# Altium schematic sheet sfp.SchDoc: SFP
size 297 x 209 mm; CheckedBy: MC, TW, EB; CompanyName: CERN; DrawnBy: Greg Kasprowicz; Organization: CERN; Address1: European Organization for Nuclear Research; Address2: CH-1211 Geneve 23 - Switzerland; DocumentNumber: 16; Revision: -; SheetNumber: 16; SheetTotal: 17; EDA_Number: EDA-02189-V4-0; Projet: Simple PCIe Carrier Board; Designer: GK, MC, TW, EB, PAS; DivGrp: BE-CO; CreateDate: 10/07/2010; CheckedDate: 11/05/2011; ModifiedBy: TW, MC; ProjectName: Simple PCIe Carrier Board
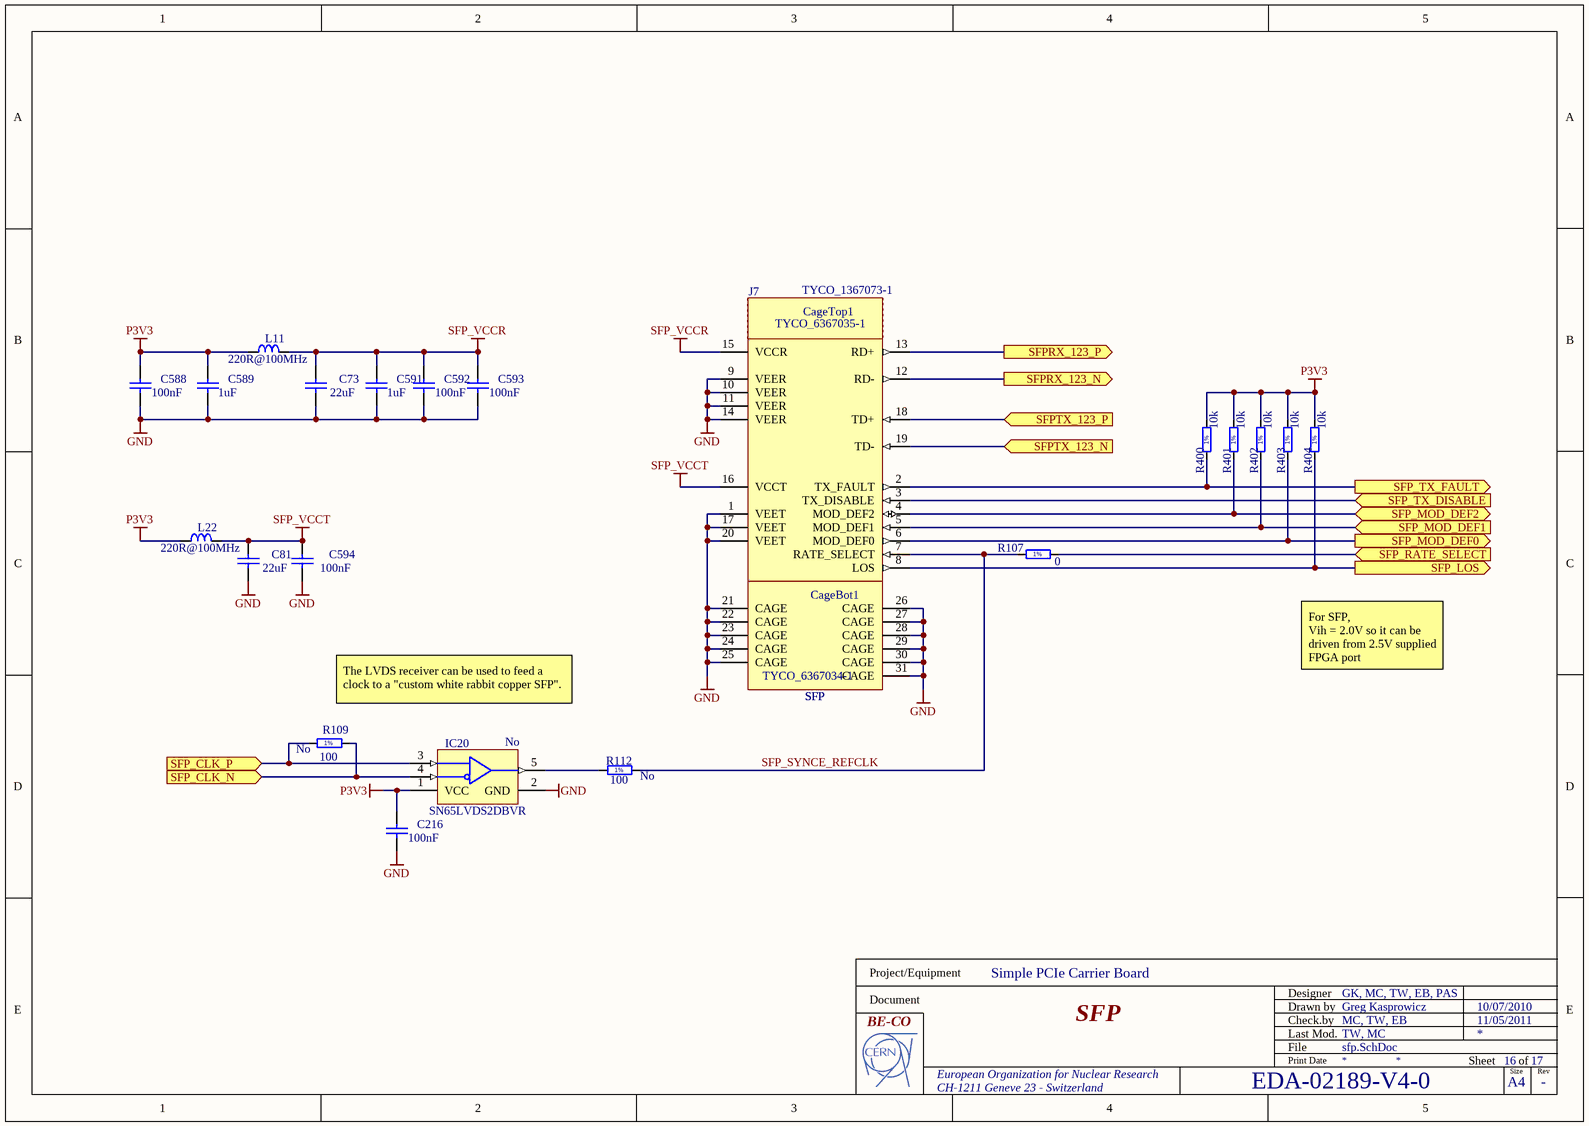
[diagram p0: sfp.SchDoc]

## Parts
C73  22uF  [CAPC3216X180N]
C81  22uF  [CAPC3216X180N]
C216  100nF  [CAPC1608X87N]
C588  100nF  [CAPC1608X87N]
C589  1uF  [CAPC1608X87N]
C591  1uF  [CAPC1608X87N]
C592  100nF  [CAPC1608X87N]
C593  100nF  [CAPC1608X87N]
C594  100nF  [CAPC1608X87N]
CageBot1  SFP  [TYCO_6367034-1]
CageTop1  SFP  [TYCO_6367035-1]
IC20  SN65LVDS2DBVR  Mounted: No  [SOT95P280X145-5N]
J7  SFP  [TYCO_1367073-1]
L11  220R@100MHz  [INDC2012X105N]
L22  220R@100MHz  [INDC2012X105N]
R107  0  [RESC1608X55N]
R109  100  Mounted: No  [RESC1608X55N]
R112  100  Mounted: No  [RESC1608X55N]
R400  10k  [RESC1608X55N]
R401  10k  [RESC1608X55N]
R402  10k  [RESC1608X55N]
R403  10k  [RESC1608X55N]
R404  10k  [RESC1608X55N]

## Ports
SFP_CLK_N (in), SFP_CLK_P (in), SFP_LOS (out), SFP_MOD_DEF0 (out), SFP_MOD_DEF1 (in), SFP_MOD_DEF2 (bidir), SFP_RATE_SELECT (in), SFP_TX_DISABLE (in), SFP_TX_FAULT (out), SFPRX_123_N (out), SFPRX_123_P (out), SFPTX_123_N (in), SFPTX_123_P (in)

## Nets
GND: C73.1 C81.1 C216.2 C588.1 C589.1 C591.1 C592.1 C593.1 C594.1 CageBot1.21(CAGE) CageBot1.22(CAGE) CageBot1.23(CAGE) CageBot1.24(CAGE) CageBot1.25(CAGE) CageBot1.26(CAGE) CageBot1.27(CAGE) CageBot1.28(CAGE) CageBot1.29(CAGE) CageBot1.30(CAGE) CageBot1.31(CAGE) IC20.2(GND) J7.1(VEET) J7.9(VEER) J7.10(VEER) J7.11(VEER) J7.14(VEER) J7.17(VEET) J7.20(VEET)
P3V3: C216.1 C588.2 C589.2 IC20.1(VCC) L11.1 L22.1 R400.2 R401.2 R402.2 R403.2 R404.2
SFP_VCCR: C73.2 C591.2 C592.2 C593.2 J7.15(VCCR) L11.2
SFP_VCCT: C81.2 C594.2 J7.16(VCCT) L22.2
SFP_CLK_N: IC20.4(B) R109.2 ; port SFP_CLK_N
SFP_CLK_P: IC20.3(A) R109.1 ; port SFP_CLK_P
SFP_LOS: J7.8(LOS) R404.1 ; port SFP_LOS
SFP_MOD_DEF0: J7.6(MOD_DEF0) R403.1 ; port SFP_MOD_DEF0
SFP_MOD_DEF1: J7.5(MOD_DEF1) R402.1 ; port SFP_MOD_DEF1
SFP_MOD_DEF2: J7.4(MOD_DEF2) R401.1 ; port SFP_MOD_DEF2
SFP_RATE_SELECT: R107.2 ; port SFP_RATE_SELECT
SFP_SYNCE_REFCLK: J7.7(RATE_SELECT) R107.1 R112.2
SFP_TX_DISABLE: J7.3(TX_DISABLE) ; port SFP_TX_DISABLE
SFP_TX_FAULT: J7.2(TX_FAULT) R400.1 ; port SFP_TX_FAULT
SFPRX_123_N: J7.12(RD-) ; port SFPRX_123_N
SFPRX_123_P: J7.13(RD+) ; port SFPRX_123_P
SFPTX_123_N: J7.19(TD-) ; port SFPTX_123_N
SFPTX_123_P: J7.18(TD+) ; port SFPTX_123_P
NetIC20_5: IC20.5(R) R112.1

## Notes on the sheet
- For SFP,
  Vih = 2.0V so it can be driven from 2.5V supplied FPGA port
- The LVDS receiver can be used to feed a clock to a "custom white rabbit copper SFP".
- Project/Equipment
- Document
- Designer
- Drawn by
- Check.by
- File
- Last Mod.
- Print Date
- Sheet
- Size
- A4
- of
- Rev
- (in symbol R0603_0R_JUMPER) 1%
- (in symbol R0603_10K_1%_0.1W_100PPM) 1%
- (in symbol R0603_100R_1%_0.1W_100PPM) 1%
- (in symbol TYCO_1367073-1) Add Cage Top Here; (Ex: TYCO_6367035-1); Add Cage Bottom Here; (Ex: TYCO_6367034-1)

## Library data of the parts
C73 C81 = CC1206_22UF_10V_10%_X7R: Non-polarised capacitor; Part Description: SMD Multilayer Chip Ceramic Capacitor; Manufacturer: GENERIC; Manufacturer1 Part Number: GRM31CR71A226KE15L; Voltage: 10V; TC: X7R; Tolerance: ±10%; Table: Capacitors SMD; Part Number: CC1206_22UF_10V_10%_X7R; Component Kind: Standard; Component Type: Standard; Pin Count: 2; Value: 22uF; Status: Preferred; Manufacturer Part Number: CC1206_22UF_10V_10%_X7R; Case: 1206; Mounted: Yes; Socket: No; SMD: Yes; Manufacturer1 Example: MURATA; Manufacturer1 ComponentHeight: 1.8mm; HelpURL: \\cern.ch\dfs\Applications\Altium\Datasheets\CC1206_X7R_MURATA_GRM-HI-CAP.pdf; Author: CERN DEM JLC; CreateDate: 2010-06-08; LatestRevisionDate: 2010-06-08
C216 C588 C592-C594 = CC0603_100NF_50V_10%_X7R: Non-polarised capacitor; Part Description: SMD Multilayer Chip Ceramic Capacitor; Manufacturer: GENERIC; Manufacturer1 Part Number: 223858615649; Voltage: 50V; TC: X7R; Tolerance: ±10%; Table: Capacitors SMD; Part Number: CC0603_100NF_50V_10%_X7R; Component Kind: Standard; Component Type: Standard; Pin Count: 2; Value: 100nF; Status: Preferred; Manufacturer Part Number: CC0603_100NF_50V_10%_X7R; Case: 0603; Mounted: Yes; Socket: No; SMD: Yes; Manufacturer1 Example: PHYCOMP; Manufacturer1 ComponentHeight: 0.87mm; HelpURL: \\cern.ch\dfs\Applications\Altium\Datasheets\CC0603_X7R_PHYCOMP.pdf; Author: CERN DEM JLC
  C216 C588 C592 C593: CreateDate: 12/3/2007; LatestRevisionDate: 12/3/2007
  C594: CreateDate: 03/12/2007; LatestRevisionDate: 03/12/2007
C589 C591 = CC0603_1UF_16V_10%_X7R: Non-polarised capacitor; Part Description: SMD Multilayer Chip Ceramic Capacitor; Manufacturer: GENERIC; Manufacturer1 Part Number: 223824613663; Voltage: 16V; TC: X7R; Tolerance: ±10%; Table: Capacitors SMD; Part Number: CC0603_1UF_16V_10%_X7R; Component Kind: Standard; Component Type: Standard; Pin Count: 2; Value: 1uF; Status: Preferred; Manufacturer Part Number: CC0603_1uF_16V_10%_X7R; Case: 0603; Mounted: Yes; Socket: No; SMD: Yes; Manufacturer1 Example: PHYCOMP; Manufacturer1 ComponentHeight: 0.87mm; HelpURL: \\cern.ch\dfs\Applications\Altium\Datasheets\CC0805_X5R_PHYCOMP_HC.pdf; Author: CERN DEM JLC; CreateDate: 03/12/2007; LatestRevisionDate: 03/12/2007
CageBot1 = TYCO_6367034-1: SFP  Cage Bottom (Small Form-factor Pluggable); Part Description: Cage bottom For Single Port SFP  (Small Form-factor Pluggable); Manufacturer: TYCO ELECTRONICS; Table: TYCO; Part Number: TYCO_6367034-1; Component Kind: Standard; Component Type: Standard; Pin Count: 11; Family: SFP; Mounted: Yes; Socket: No; SMD: No; Status: None; Manufacturer Part Number: TYCO_6367034-1; ComponentHeight: 8.8mm; ComponentLink1URL: \\cern.ch\dfs\Applications\Altium\Datasheets\TYCO_SFP_Application.pdf; ComponentLink1Description: Application; ComponentLink2URL: \\cern.ch\dfs\Applications\Altium\Datasheets\Tyco_SFP_Specification.pdf; ComponentLink2Description: SFP Specification; HelpURL: \\cern.ch\dfs\Applications\Altium\Datasheets\TYCO_6367034-1.pdf; Author: CERN DEM JLC; CreateDate: 25.01.2010; LatestRevisionDate: 25.01.2010; ClassName: Component_Not_DRC
CageTop1 = TYCO_6367035-1: SFP  Cage Top (Small Form-factor Pluggable); Part Description: Cage Top For Single Port SFP  (Small Form-factor Pluggable); Manufacturer: TYCO ELECTRONICS; Table: TYCO; Part Number: TYCO_6367035-1; Component Kind: Standard; Component Type: Standard; Designator: SFPx1_Cage Top; Library Reference: SFPx1_Cage Top; Pin Count: 0; Family: SFP; Mounted: Yes; Socket: No; SMD: No; Status: None; Manufacturer Part Number: TYCO_6367035-1; ComponentHeight: 10mm; Datasheet: \\cern.ch\dfs\Applications\Altium\Datasheets\TYCO_6367035-1.pdf; ComponentLink1URL: \\cern.ch\dfs\Applications\Altium\Datasheets\TYCO_SFP_Application.pdf; ComponentLink1Description: Application; ComponentLink2URL: \\cern.ch\dfs\Applications\Altium\Datasheets\Tyco_SFP_Specification.pdf; ComponentLink2Description: SFP Specification; HelpURL: \\cern.ch\dfs\Applications\Altium\Datasheets\TYCO_6367035-1.pdf; Author: CERN DEM JLC; CreateDate: 25/01/2010; LatestRevisionDate: 25/01/2010; ClassName: Component_Not_DRC
IC20 = SN65LVDS2DBVR: High-Speed Differential Line Receiver; Manufacturer: TEXAS INSTRUMENTS; Table: Analog & Interface; Part Number: SN65LVDS2DBVR; Component Kind: Standard; Component Type: Standard; Device: SN65LVDS2DBVR; PackageDescription: SOT, 0.95mm pitch; 5 pin, 1.60mm W X 2.90mm L X 1.45mm H body, IPC Medium Density; Part Description: High-Speed Differential Line Receiver; Manufacturer Part Number: SN65LVDS2DBVR; Pin Count: 5; Case: SOT23-5; Socket: No; SMD: Yes; ComponentHeight: 1.45mm; Author: CERN DEM JLC; HelpURL: \\cern.ch\dfs\Applications\Altium\Datasheets\SN65LVDS2DBVR.pdf; CreateDate: 3/3/2011; LatestRevisionDate: 3/3/2011
J7 = TYCO_1367073-1: 20 Position SFP  Connector (Small Form-factor Pluggable); Part Description: 20 Position, Pitch 0.8mm SFP  Receptacle (Small Form-factor Pluggable); Manufacturer: TYCO ELECTRONICS; Table: TYCO; Part Number: TYCO_1367073-1; Component Kind: Standard; Component Type: Standard; Pin Count: 20; Family: SFP; Mounted: Yes; Socket: No; SMD: Yes; Status: None; Manufacturer Part Number: 1367073-1; ComponentHeight: 5.4mm; ComponentLink1URL: \\cern.ch\dfs\Applications\Altium\Datasheets\TYCO_SFP_Application.pdf; ComponentLink1Description: Application; ComponentLink2URL: \\cern.ch\dfs\Applications\Altium\Datasheets\Tyco_SFP_Specification.pdf; ComponentLink2Description: SFP Specification; HelpURL: \\cern.ch\dfs\Applications\Altium\Datasheets\TYCO_1367073-1.pdf; Author: CERN DEM JLC; CreateDate: 25/01/2010; LatestRevisionDate: 25/01/2010
L11 L22 = IND0805_MURATA_BLM21PG221SN1D: Inductor; Part Description: SMD EMIFIL Suppression Chip Bead Ferrite; Manufacturer: MURATA; Power: 2A; Resistance: 0.05R; Tolerance: ±25%; Table: Inductors SMD; Part Number: IND0805_MURATA_BLM21PG221SN1D; Component Kind: Standard; Component Type: Standard; Pin Count: 2; Value: 220R@100MHz; Status: None; Manufacturer Part Number: BLM21PG221SN1D; Case: 0805; Mounted: Yes; Socket: No; SMD: Yes; ComponentHeight: 1.05mm; HelpURL: \\cern.ch\dfs\Applications\Altium\Datasheets\IND0402_MURATA_BLM21P.pdf; Author: CERN DEM JLC; CreateDate: 25/01/2010; LatestRevisionDate: 25/01/2010
R107 = R0603_0R_JUMPER: Resistor - 1%; Part Description: 1A (0.05R Max DC Resistance) Zero Ohm Jumper; Manufacturer: GENERIC; Manufacturer1 Part Number: NRC06Z0; Table: Resistors SMD; Part Number: R0603_0R_JUMPER; Component Kind: Standard; Component Type: Standard; Pin Count: 2; Value: 0; Status: Preferred; Manufacturer Part Number: R0603_0R_JUMPER; Case: 0603; Mounted: Yes; Socket: No; SMD: Yes; Manufacturer1 Example: NIC COMPONENT; Manufacturer1 ComponentHeight: 0.55mm; HelpURL: \\cern.ch\dfs\Applications\Altium\Datasheets\R0603_NIC_NRC.pdf; Author: CERN DEM JLC; CreateDate: 12/3/2007; LatestRevisionDate: 3/13/2008
R109 R112 = R0603_100R_1%_0.1W_100PPM: Resistor - 1%; Part Description: General Purpose Thick Film Chip Resistor; Manufacturer: GENERIC; Manufacturer1 Part Number: NRC06F4700TRF; Power: 0.1W; TC: ±100ppm/°C; Table: Resistors SMD; Part Number: R0603_100R_1%_0.1W_100PPM; Component Kind: Standard; Component Type: Standard; Pin Count: 2; Value: 100; Status: Preferred; Tolerance: ±1%; Manufacturer Part Number: R0603_100R_1%_0.1W_100PPM; Case: 0603; Socket: No; SMD: Yes; Manufacturer1 Example: NIC COMPONENT; Manufacturer1 ComponentHeight: 0.55mm; HelpURL: \\cern.ch\dfs\Applications\Altium\Datasheets\R0603_NIC_NRC.pdf; Author: CERN DEM JLC; CreateDate: 12/3/2007; LatestRevisionDate: 3/13/2008
R400-R404 = R0603_10K_1%_0.1W_100PPM: Resistor - 1%; Part Description: General Purpose Thick Film Chip Resistor; Manufacturer: GENERIC; Manufacturer1 Part Number: NRC06F1002TRF; Power: 0.1W; TC: ±100ppm/°C; Table: Resistors SMD; Part Number: R0603_10K_1%_0.1W_100PPM; Component Kind: Standard; Component Type: Standard; Pin Count: 2; Value: 10k; Status: Preferred; Tolerance: ±1%; Manufacturer Part Number: R0603_10K_1%_0.1W_100PPM; Case: 0603; Mounted: Yes; Socket: No; SMD: Yes; Manufacturer1 Example: NIC COMPONENT; Manufacturer1 ComponentHeight: 0.55mm; HelpURL: \\cern.ch\dfs\Applications\Altium\Datasheets\R0603_NIC_NRC.pdf; Author: CERN DEM JLC; CreateDate: 12/3/2007; LatestRevisionDate: 3/13/2008